# Altium schematic sheet BLINKING.SchDoc
size A; SheetNumber: 2; SheetTotal: 2
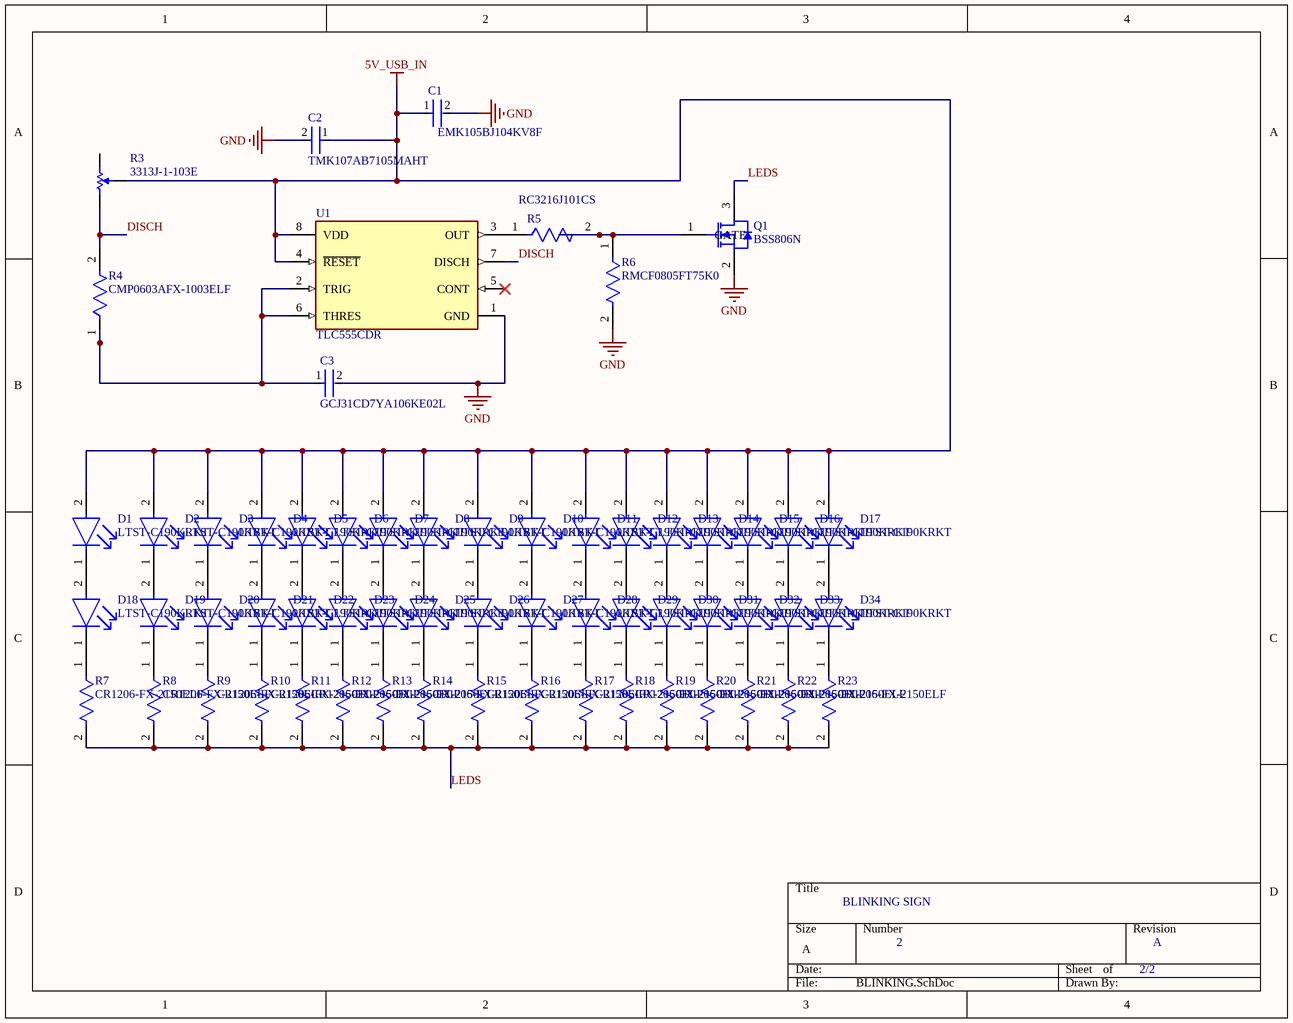
[diagram p0: BLINKING.SchDoc]

## Parts
C1  EMK105BJ104KV8F  [FP-0402-L_1_0_0_05-W_0_5-MFG]
C2  TMK107AB7105MAHT  [FP-0603-L_1_6_0_15-W_0_8-IPC_B]
C3  GCJ31CD7YA106KE02L  [FP-GCJ31C-0_4-IPC_C]
D1  LTST-C190KRKT  [FP-LTST-C190KRKT-MFG]
D2  LTST-C190KRKT  [FP-LTST-C190KRKT-MFG]
D3  LTST-C190KRKT  [FP-LTST-C190KRKT-MFG]
D4  LTST-C190KRKT  [FP-LTST-C190KRKT-MFG]
D5  LTST-C190KRKT  [FP-LTST-C190KRKT-MFG]
D6  LTST-C190KRKT  [FP-LTST-C190KRKT-MFG]
D7  LTST-C190KRKT  [FP-LTST-C190KRKT-MFG]
D8  LTST-C190KRKT  [FP-LTST-C190KRKT-MFG]
D9  LTST-C190KRKT  [FP-LTST-C190KRKT-MFG]
D10  LTST-C190KRKT  [FP-LTST-C190KRKT-MFG]
D11  LTST-C190KRKT  [FP-LTST-C190KRKT-MFG]
D12  LTST-C190KRKT  [FP-LTST-C190KRKT-MFG]
D13  LTST-C190KRKT  [FP-LTST-C190KRKT-MFG]
D14  LTST-C190KRKT  [FP-LTST-C190KRKT-MFG]
D15  LTST-C190KRKT  [FP-LTST-C190KRKT-MFG]
D16  LTST-C190KRKT  [FP-LTST-C190KRKT-MFG]
D17  LTST-C190KRKT  [FP-LTST-C190KRKT-MFG]
D18  LTST-C190KRKT  [FP-LTST-C190KRKT-MFG]
D19  LTST-C190KRKT  [FP-LTST-C190KRKT-MFG]
D20  LTST-C190KRKT  [FP-LTST-C190KRKT-MFG]
D21  LTST-C190KRKT  [FP-LTST-C190KRKT-MFG]
D22  LTST-C190KRKT  [FP-LTST-C190KRKT-MFG]
D23  LTST-C190KRKT  [FP-LTST-C190KRKT-MFG]
D24  LTST-C190KRKT  [FP-LTST-C190KRKT-MFG]
D25  LTST-C190KRKT  [FP-LTST-C190KRKT-MFG]
D26  LTST-C190KRKT  [FP-LTST-C190KRKT-MFG]
D27  LTST-C190KRKT  [FP-LTST-C190KRKT-MFG]
D28  LTST-C190KRKT  [FP-LTST-C190KRKT-MFG]
D29  LTST-C190KRKT  [FP-LTST-C190KRKT-MFG]
D30  LTST-C190KRKT  [FP-LTST-C190KRKT-MFG]
D31  LTST-C190KRKT  [FP-LTST-C190KRKT-MFG]
D32  LTST-C190KRKT  [FP-LTST-C190KRKT-MFG]
D33  LTST-C190KRKT  [FP-LTST-C190KRKT-MFG]
D34  LTST-C190KRKT  [FP-LTST-C190KRKT-MFG]
Q1  BSS806N  [INF-PG-SOT23_M]
R3  3313J-1-103E  [BOUR-3313J-1_V]
R4  CMP0603AFX-1003ELF  [FP-CMP0603A-MFG]
R5  RC3216J101CS  [FP-RC3216-IPC_B]
R6  RMCF0805FT75K0  [FP-RMCF0805-IPC_B]
R7  CR1206-FX-2150ELF  [FP-CR1206-IPC_B]
R8  CR1206-FX-2150ELF  [FP-CR1206-IPC_B]
R9  CR1206-FX-2150ELF  [FP-CR1206-IPC_B]
R10  CR1206-FX-2150ELF  [FP-CR1206-IPC_B]
R11  CR1206-FX-2150ELF  [FP-CR1206-IPC_B]
R12  CR1206-FX-2150ELF  [FP-CR1206-IPC_B]
R13  CR1206-FX-2150ELF  [FP-CR1206-IPC_B]
R14  CR1206-FX-2150ELF  [FP-CR1206-IPC_B]
R15  CR1206-FX-2150ELF  [FP-CR1206-IPC_B]
R16  CR1206-FX-2150ELF  [FP-CR1206-IPC_B]
R17  CR1206-FX-2150ELF  [FP-CR1206-IPC_B]
R18  CR1206-FX-2150ELF  [FP-CR1206-IPC_B]
R19  CR1206-FX-2150ELF  [FP-CR1206-IPC_B]
R20  CR1206-FX-2150ELF  [FP-CR1206-IPC_B]
R21  CR1206-FX-2150ELF  [FP-CR1206-IPC_B]
R22  CR1206-FX-2150ELF  [FP-CR1206-IPC_B]
R23  CR1206-FX-2150ELF  [FP-CR1206-IPC_B]
U1  TLC555CDR  [FP-D0008A-IPC_B]

## Nets
5V_USB_IN: C1.1 C2.1 D1.2(A) D2.2(A) D3.2(A) D4.2(A) D5.2(A) D6.2(A) D7.2(A) D8.2(A) D9.2(A) D10.2(A) D11.2(A) D12.2(A) D13.2(A) D14.2(A) D15.2(A) D16.2(A) D17.2(A) R3.2 U1.4(~{RESET}) U1.8(VDD)
GND: C1.2 C2.2 C3.2 Q1.2(SOURCE) R6.2 U1.1(GND)
DISCH: R3.1 R4.2 U1.7(DISCH)
LEDS: Q1.3(DRAIN) R7.2 R8.2 R9.2 R10.2 R11.2 R12.2 R13.2 R14.2 R15.2 R16.2 R17.2 R18.2 R19.2 R20.2 R21.2 R22.2 R23.2
NetC3_1: C3.1 R4.1 U1.2(TRIG) U1.6(THRES)
NetD1_1: D1.1(C) D18.2(A)
NetD2_1: D2.1(C) D19.2(A)
NetD3_1: D3.1(C) D20.2(A)
NetD4_1: D4.1(C) D21.2(A)
NetD5_1: D5.1(C) D22.2(A)
NetD6_1: D6.1(C) D23.2(A)
NetD7_1: D7.1(C) D24.2(A)
NetD8_1: D8.1(C) D25.2(A)
NetD9_1: D9.1(C) D26.2(A)
NetD10_1: D10.1(C) D27.2(A)
NetD11_1: D11.1(C) D28.2(A)
NetD12_1: D12.1(C) D29.2(A)
NetD13_1: D13.1(C) D30.2(A)
NetD14_1: D14.1(C) D31.2(A)
NetD15_1: D15.1(C) D32.2(A)
NetD16_1: D16.1(C) D33.2(A)
NetD17_1: D17.1(C) D34.2(A)
NetD18_1: D18.1(C) R7.1
NetD19_1: D19.1(C) R8.1
NetD20_1: D20.1(C) R9.1
NetD21_1: D21.1(C) R10.1
NetD22_1: D22.1(C) R11.1
NetD23_1: D23.1(C) R12.1
NetD24_1: D24.1(C) R13.1
NetD25_1: D25.1(C) R14.1
NetD26_1: D26.1(C) R15.1
NetD27_1: D27.1(C) R16.1
NetD28_1: D28.1(C) R17.1
NetD29_1: D29.1(C) R18.1
NetD30_1: D30.1(C) R19.1
NetD31_1: D31.1(C) R20.1
NetD32_1: D32.1(C) R21.1
NetD33_1: D33.1(C) R22.1
NetD34_1: D34.1(C) R23.1
NetQ1_1: Q1.1(GATE) R5.2 R6.1
NetR5_1: R5.1 U1.3(OUT)

Not connected (* = marked no-connect by the designer): R3 3; U1 5(CONT)*

## Notes on the sheet
- BLINKING SIGN
- 2
- 2/2
- A

## Library data of the parts
C1 = CMP-14477-001971-2: None
C2 = CMP-14477-003841-2: None; Voltage Rating: 25V; Capacitance: 1uF; Tolerance: 20%; Thickness: 0.037inch; RoHS Compliant: Yes; Mount: Surface Mount; Length: 0.063inch; Case/Package: 0603; Max Operating Temperature: 125°C; Packaging: Tape and Reel; Width: 0.031inch; Ratings: AEC-Q200; Min Operating Temperature: -55°C
C3 = CMP-06035-004889-1: Cap Ceramic 10uF 35V X7T 10% SMD 1206 +125°C Embossed Plastic T/R
D1-D34 = CMP-1674-00011-2: LED RED CLEAR CHIP SMD; Reverse Voltage: 5V; Viewing Angle: 130°; Power Rating: 75mW; Test Current: 20mA; Number of Elements: 1; Lens Color: Colorless; Wavelength: 639nm; Dominant Wavelength: 631nm; Lens Style: Diffused; Forward Current: 30mA; Forward Voltage: 2.4V; Luminous Intensity: 54mcd; Color: Red; Case Code (Imperial): 0603; Lens Transparency: Clear; Lead Free: Lead Free; Package Quantity: 1; Packaging: Tape and Reel; Max Operating Temperature: 85°C; Number of Pins: 2; Height: 0.8mm; Case/Package: 0603; Number of LEDs: 1; Width: 0.8mm; Case Code (Metric): 1608; Depth: 0.8mm; Mount: Surface Mount; Radiation Hardening: No; Length: 1.6mm; Illumination Color: Red; Power Dissipation: 75mW; Min Operating Temperature: -55°C
Q1 = CMP-1149-00036-1: N-Channel OptiMOS 2 Small-Signal-Transistor, 20 V VDS, 2.3 A ID, -55 to 150 degC, PG-SOT23, Reel, Green; Manufacturer: Infineon; VDS (max): 20 V; RthJA (max): 250 K/W; VGS(th) (max): 0.75Â V; QG: 1.7Â nC; RDS (on) (max) (@2.5V): 57 mOhm; VGS(th) (min): 0.3Â V; Ptot (max): 0.5Â W; Green: TRUE; IDpuls (max): 9.3Â A; ID (max): 2.3Â A; RDS (on) (max) (@1.8V): 82 mOhm; Halogen-free: TRUE; PackageVersion: Apr-08; PackageReference: PG-SOT23; PackageDescription: 3-Pin Small Outline Transistor Package, 2.9 x 1.3 mm Body, 0.95 mm Pitch; ComponentLink3URL: http://www.infineon.com/dgdl/SOT23-Package_Overview.pdf?folderId=db3a30431936bc4b0119532290053c66&fileId=db3a30431936bc4b0119533468123c85; ComponentLink3Description: Package Specification; ComponentLink2Description: Datasheet; Packing: Reel; Mounting Technology: Surface Mount; PartNumber: BSS806N; RDS (on) (max): 57 mOhm; ComponentLink2URL: http://www.infineon.com/dgdl/BSS806N_Rev2.3_.pdf?folderId=db3a3043156fd573011622e10b5c1f67&fileId=db3a304330f686060131185f0553451c; ComponentLink1URL: http://www.infineon.com/; ComponentLink1Description: Manufacturer URL; DatasheetVersion: Rev. 2.3
R3 = CMP-2000-05585-1: Trimming Potentiometer, 10 KOhm, -55 to 125 degC, 3-Pin SMD, RoHS, Tape and Reel; Manufacturer: Bourns; Resistance Tolerance: ±20%; Track Resistance: 10kohm; SVHC: NoSVHC(16-Jun-2014); No. of Turns: 1; Temperature Coefficient: ±100ppm/°C; Power Rating: 125mW; Potentiometer Mounting: SMD; RoHS Compliant: Yes; Datasheet URL: http://www.bourns.com/docs/Product-Datasheets/3313.pdf; Mounting Technology: SurfaceMount; Manufacturer URL: http://www.bourns.com/; Package Description: 3-Pin Surface Mount Device, Body 3.5 x 3.2 mm, Pitch 1.15 mm; Package Reference: 3313J-1; Datasheet Version: 05/2016
R4 = CMP-07231-006018-1: RESHIGHPOWERA 0603 100K 1% 1/4W
R5 = CMP-13261-003683-1: Res Thick Film 1206 100Ω 5% 0.25W ±100ppm/°C Molded SMD T/R; Voltage Rating (DC): 200V; Resistance: 100R; Max Power Dissipation: 250mW; Radiation Hardening: No; Tolerance: 5%; Packaging: Tape and Reel; Case Code (Metric): 3216; Min Operating Temperature: -55°C; Composition: Thick Film; Max Operating Temperature: 155°C; Lead Free: Lead Free; Contact Plating: Tin; Case Code (Imperial): 1206; Number of Terminations: 2; Depth: 1.6mm; Case/Package: 1206; Power Rating: 250mW; Temperature Coefficient: 100ppm/°C; Mount: Surface Mount; Height: 0.026inch; Width: 0.063inch; Length: 0.126inch; Features: Moisture Resistant; Military Standard: Not; Package Quantity: 1
R6 = CMP-26527-001520-1: 75kΩ ±1% 0.125W 0805 Thick Film Chip Resistor AEC-Q200 compliant; Max Power Dissipation: 125mW; Temperature Coefficient: 100ppm/°C; Resistance: 75kR; Contact Plating: Tin; Width: 0.049inch; Resistor Type: Thick Film; Radiation Hardening: No; Mount: Surface Mount; Height: 0.026inch; Case/Package: 0805; Depth: 1.25mm; Max Operating Temperature: 155°C; Case Code (Imperial): 0805; Case Code (Metric): 2012; Min Operating Temperature: -55°C; Series: RMCF; Number of Terminations: 2; Features: Automotive AEC-Q200; Packaging: Tape and Reel; Construction: Rectangular; Tolerance: 1%; RoHS Compliant: Yes; Length: 0.079inch; Military Standard: Not
R7-R23 = CMP-07231-000755-1: Thick Film Chip Resistors 1206 215Ω 0.25W 1% 100ppm/°C; Power Rating: 250mW; Voltage Rating: 200V; Resistance: 215R; Case Code (Imperial): 1206; Number of Terminations: 2; Length: 3.2mm; Composition: Thick Film; Width: 0.063inch; Military Standard: Not; Features: Moisture Resistant; Temperature Coefficient: 100ppm/°C; Packaging: Tape and Reel; Contact Plating: Tin; Min Operating Temperature: -55°C; Radiation Hardening: No; Case Code (Metric): 3216; Max Operating Temperature: 155°C; Package Quantity: 5000; Depth: 1.6mm; Thickness: 610um; Height: 0.03inch; Case/Package: 1206; Max Power Dissipation: 250mW; Tolerance: 1%; Mount: Surface Mount; Termination: SMD/SMT
U1 = CMP-04857-000001-1: IC OSC SGL TIMER 2.1MHZ 8-SOIC; Min Supply Voltage: 2V; Number of Channels: 1; Max Power Dissipation: 725mW; Max Supply Voltage: 15V; Low Level Output Current: 100mA; Current Rating: 250A; Quiescent Current: 250uA; Operating Supply Current: 360uA; High Level Output Current: -10mA; Width: 3.91mm; Case/Package: SOIC; Weight: 0.002561oz; Frequency: 2.1MHz; Height: 1.58mm; Package Quantity: 2500; REACH SVHC: No SVHC; Number of Timers/Counters: 1; Lead Free: Lead Free; Number of Pins: 8; Max Operating Temperature: 125°C; Min Operating Temperature: -40°C; Length: 4.9mm; Radiation Hardening: No; Packaging: Tape and Reel; Termination: SMD/SMT; Mount: Surface Mount; Power Dissipation: 725mW